# Altium schematic sheet buck_boost.SchDoc
size A4
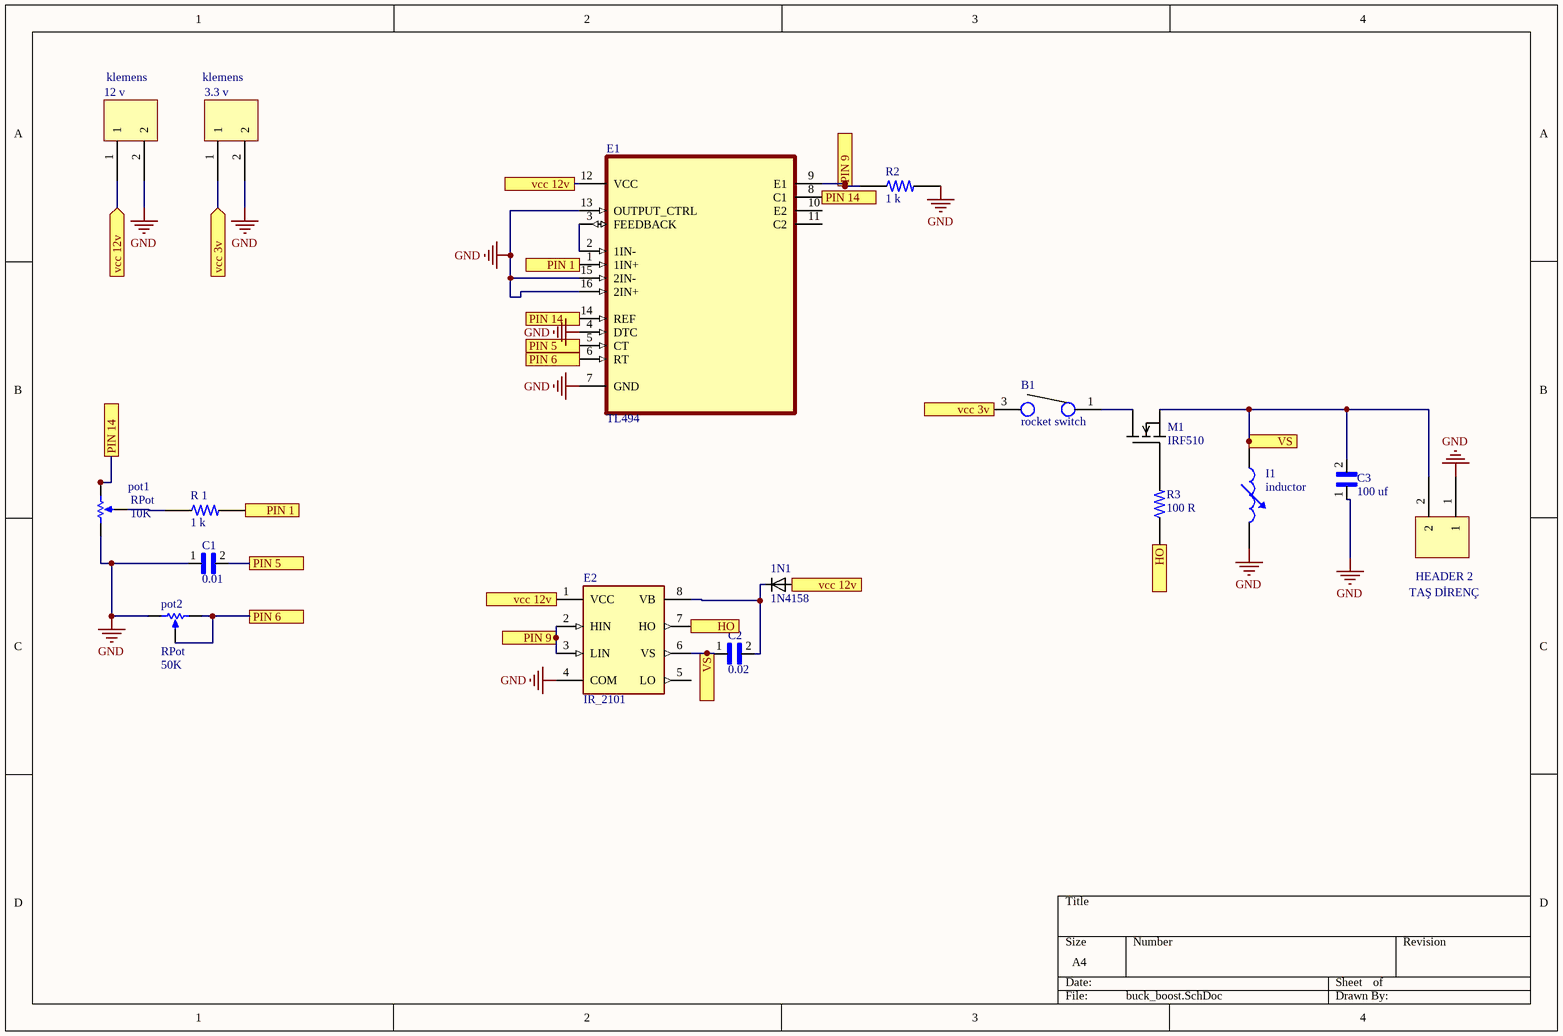
[diagram p0: buck_boost.SchDoc]

## Parts
1N1  1N4158  [1N4158]
3.3_v  klemens  [klemens]
12_v  klemens  [klemens]
B1  rocket switch  [rocket switch]
C1  0.01  [0,01 uf]
C2  0.02  [0,22uf]
C3  100 uf  [100 uf]
E1  TL494  [TL_494]
E2  IR_2101  [IR_2101]
I1  inductor  [induktor]
M1  IRF510  [IRF510]
pot1  RPot  value 10K  [pot]
pot2  RPot  value 50K  [pot]
R2  1 k  [1k]
R3  100 R  [100R]
R_1  1 k  [1k]
TAŞ_DİRENÇ  HEADER 2  [HEADER 2]

## Ports
HO, PIN 1, PIN 5, PIN 6, PIN 9, PIN 14, vcc 3v, vcc 3v (in), vcc 12v, vcc 12v (in), VS

## Nets
GND: 3.3_v.2 12_v.2 C1.1 C3.1 E1.4(DTC) E1.7(GND) E1.13(OUTPUT_CTRL) E1.15(2IN-) E1.16(2IN+) E2.4(COM) I1.2 pot1.1(TOP) pot2.1(TOP) R2.2 TAŞ_DİRENÇ.1
HO: E2.7(HO) R3.1 ; port HO
PIN 1: E1.1(1IN+) R_1.2 ; port PIN 1
PIN 5: C1.2 E1.5(CT) ; port PIN 5
PIN 6: E1.6(RT) pot2.2(BOT) pot2.3(TAP) ; port PIN 6
PIN 9: E1.9(E1) E2.2(HIN) E2.3(LIN) R2.1 ; port PIN 9
PIN 14: E1.8(C1) E1.14(REF) pot1.2(BOT) ; port PIN 14
vcc 3v: 3.3_v.1 B1.3 ; port vcc 3v
vcc 12v: 1N1.A 12_v.1 E1.12(VCC) E2.1(VCC) ; port vcc 12v
VS: C2.1 C3.2 E2.6(VS) I1.1 M1.3(S) TAŞ_DİRENÇ.2 ; port VS
Net1N1_C: 1N1.C C2.2 E2.8(VB)
NetB1_1: B1.1 M1.2(D)
NetE1_2: E1.2(1IN-) E1.3(FEEDBACK)
NetM1_1: M1.1(G) R3.2
Netpot1_3: pot1.3(TAP) R_1.1

Not connected (* = marked no-connect by the designer): E1 10(E2) 11(C2); E2 5(LO)

## Library data of the parts
C1 = 0,01 uf
C2 = 0,22 uf
pot1 pot2 = RPot: Potentiometer; Sim Note: Enter the Resistance value and the set point into parameter fields.; Set Position: 0.5; Published: 8-Jun-2000; LatestRevisionDate: 17-Jul-2002; LatestRevisionNote: Re-released for DXP Platform.; PackageReference: VR5; Publisher: Altium Limited; PackageDescription: Variable Resistor, Thru-Hole; 3 Leads
R3 = 100R